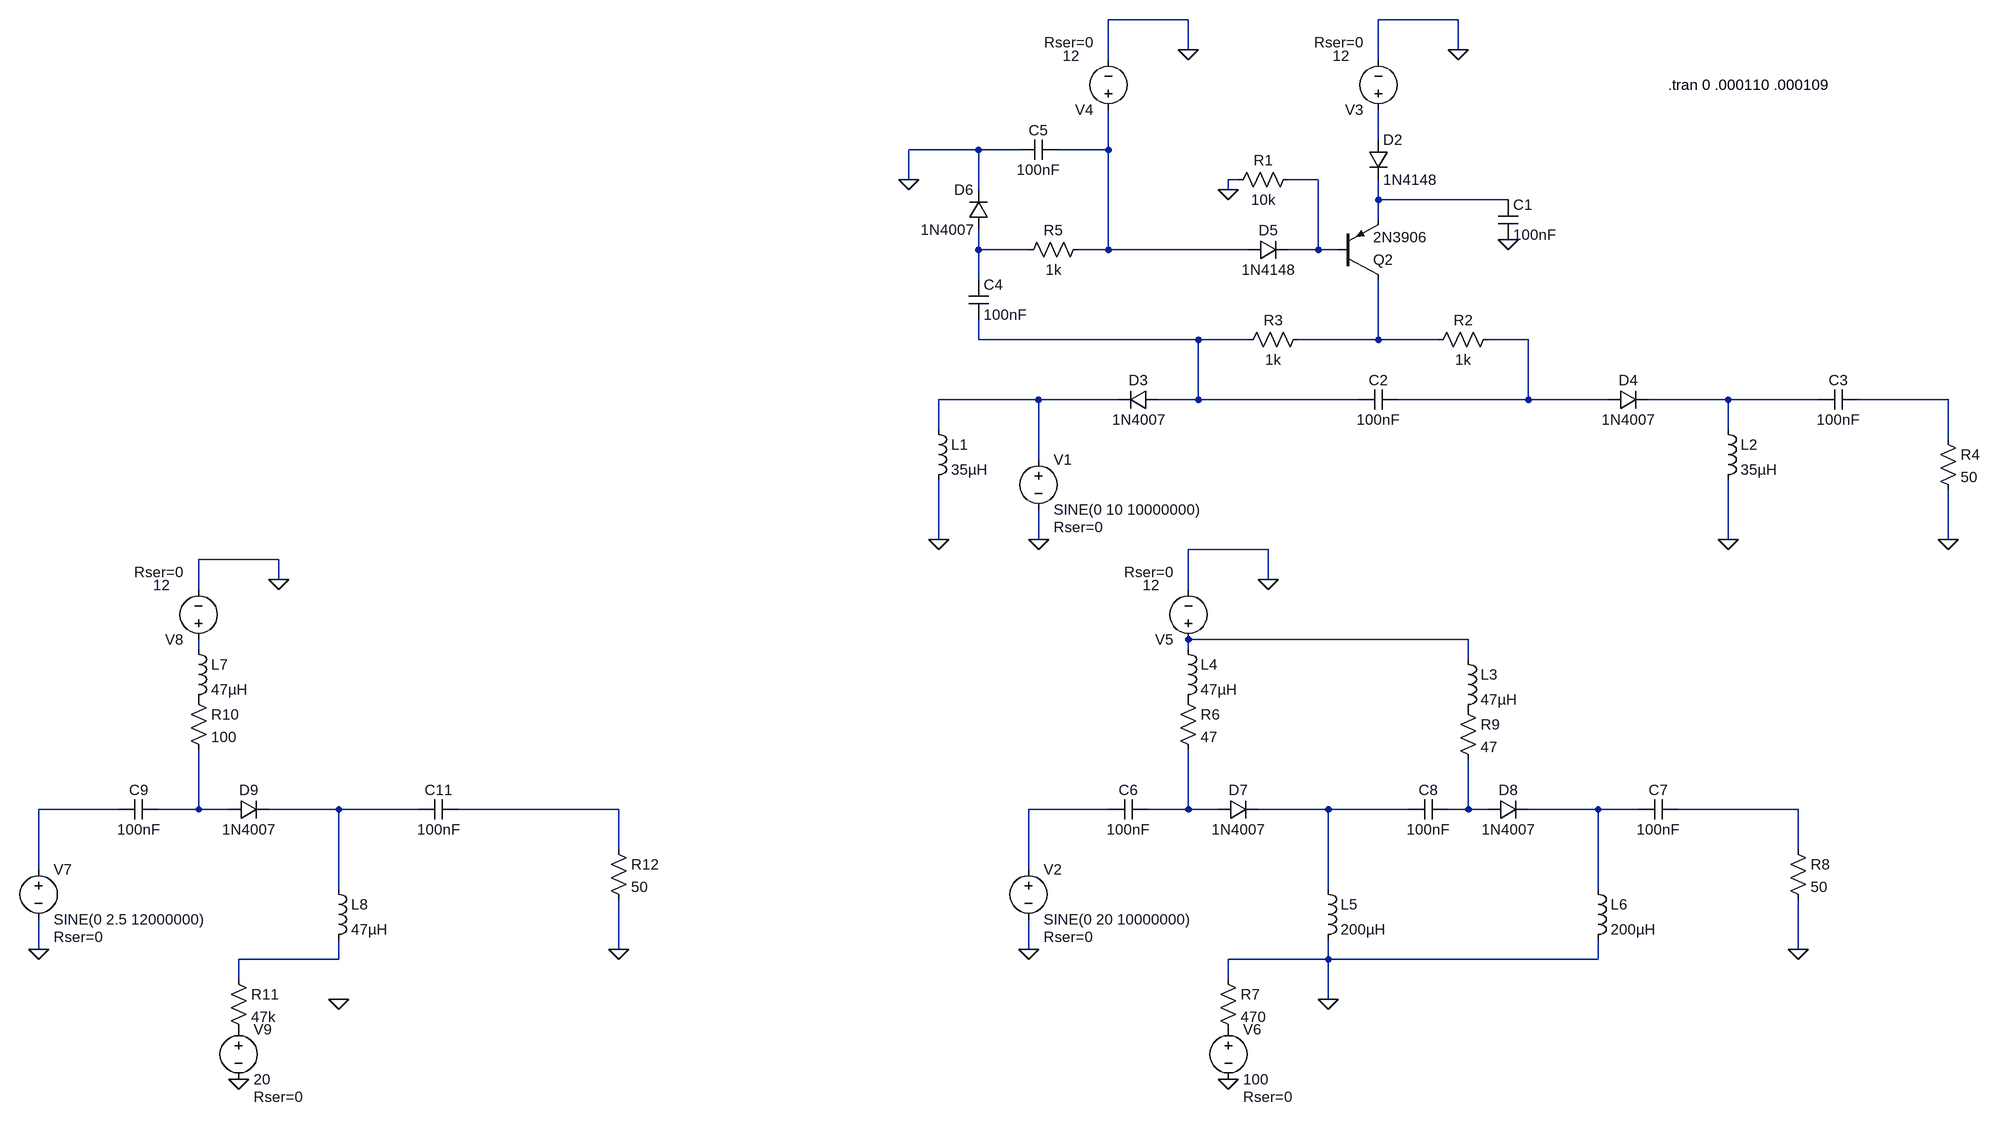
[diagram p0: schematic Pin Diodes.asc]
Pin Diodes.asc, the LTspice schematic file:
Version 4
SHEET 1 1732 1196
WIRE 192 -544 64 -544
WIRE 624 -544 496 -544
WIRE 192 -496 192 -544
WIRE 624 -496 624 -544
WIRE 64 -480 64 -544
WIRE 496 -480 496 -544
WIRE 496 -352 496 -400
WIRE -144 -336 -256 -336
WIRE -80 -336 -144 -336
WIRE 64 -336 64 -400
WIRE 64 -336 -16 -336
WIRE -256 -288 -256 -336
WIRE 272 -288 256 -288
WIRE 400 -288 352 -288
WIRE -144 -272 -144 -336
WIRE 256 -272 256 -288
WIRE 496 -256 496 -288
WIRE 704 -256 496 -256
WIRE 496 -224 496 -256
WIRE -144 -176 -144 -208
WIRE -64 -176 -144 -176
WIRE 64 -176 64 -336
WIRE 64 -176 16 -176
WIRE 288 -176 64 -176
WIRE 400 -176 400 -288
WIRE 400 -176 352 -176
WIRE 432 -176 400 -176
WIRE -144 -128 -144 -176
WIRE -144 -32 -144 -64
WIRE 208 -32 -144 -32
WIRE 288 -32 208 -32
WIRE 496 -32 496 -128
WIRE 496 -32 368 -32
WIRE 592 -32 496 -32
WIRE 736 -32 672 -32
WIRE -48 64 -208 64
WIRE 80 64 -48 64
WIRE 208 64 208 -32
WIRE 208 64 144 64
WIRE 464 64 208 64
WIRE 736 64 736 -32
WIRE 736 64 528 64
WIRE 864 64 736 64
WIRE 1056 64 928 64
WIRE 1200 64 1056 64
WIRE 1408 64 1264 64
WIRE -208 112 -208 64
WIRE 1056 112 1056 64
WIRE 1408 128 1408 64
WIRE -48 160 -48 64
WIRE -208 288 -208 192
WIRE -48 288 -48 240
WIRE 1056 288 1056 192
WIRE 1408 288 1408 208
WIRE 320 304 192 304
WIRE -1264 320 -1392 320
WIRE -1264 352 -1264 320
WIRE 320 352 320 304
WIRE -1392 368 -1392 320
WIRE 192 368 192 304
WIRE 640 448 192 448
WIRE -1392 464 -1392 448
WIRE 192 464 192 448
WIRE 640 480 640 448
WIRE -1520 720 -1648 720
WIRE -1392 720 -1392 624
WIRE -1392 720 -1456 720
WIRE -1344 720 -1392 720
WIRE -1168 720 -1280 720
WIRE -1040 720 -1168 720
WIRE -720 720 -976 720
WIRE 64 720 -64 720
WIRE 192 720 192 624
WIRE 192 720 128 720
WIRE 240 720 192 720
WIRE 416 720 304 720
WIRE 544 720 416 720
WIRE 640 720 640 640
WIRE 640 720 608 720
WIRE 672 720 640 720
WIRE 848 720 736 720
WIRE 912 720 848 720
WIRE 1168 720 976 720
WIRE -720 784 -720 720
WIRE 1168 784 1168 720
WIRE -1648 816 -1648 720
WIRE -64 816 -64 720
WIRE -1168 848 -1168 720
WIRE 416 848 416 720
WIRE 848 848 848 720
WIRE -1648 944 -1648 896
WIRE -720 944 -720 864
WIRE -64 944 -64 896
WIRE 1168 944 1168 864
WIRE -1168 960 -1168 928
WIRE -1168 960 -1328 960
WIRE 416 960 416 928
WIRE 416 960 256 960
WIRE 848 960 848 928
WIRE 848 960 416 960
WIRE -1328 992 -1328 960
WIRE 256 992 256 960
WIRE 416 1024 416 960
FLAG -48 288 0
FLAG 624 -496 0
FLAG 192 -496 0
FLAG 704 -192 0
FLAG 256 -272 0
FLAG -208 288 0
FLAG 1056 288 0
FLAG 1408 288 0
FLAG -256 -288 0
FLAG -64 944 0
FLAG 320 352 0
FLAG 1168 944 0
FLAG 256 1152 0
FLAG 416 1024 0
FLAG -1648 944 0
FLAG -1264 352 0
FLAG -720 944 0
FLAG -1328 1152 0
FLAG -1168 1024 0
SYMBOL voltage -48 144 R0
WINDOW 123 0 0 Left 0
WINDOW 39 24 124 Left 2
SYMATTR SpiceLine Rser=0
SYMATTR InstName V1
SYMATTR Value SINE(0 10 10000000)
SYMBOL voltage 496 -384 R180
WINDOW 123 0 0 Left 0
WINDOW 39 24 124 Left 2
WINDOW 3 46 103 Left 2
SYMATTR SpiceLine Rser=0
SYMATTR Value 12
SYMATTR InstName V3
SYMBOL voltage 64 -384 R180
WINDOW 123 0 0 Left 0
WINDOW 39 24 124 Left 2
WINDOW 3 46 103 Left 2
SYMATTR SpiceLine Rser=0
SYMATTR Value 12
SYMATTR InstName V4
SYMBOL pnp 432 -128 M180
SYMATTR InstName Q2
SYMATTR Value 2N3906
SYMBOL diode 480 -352 R0
SYMATTR InstName D2
SYMATTR Value 1N4148
SYMBOL res 368 -304 R90
WINDOW 0 0 56 VBottom 2
WINDOW 3 32 56 VTop 2
SYMATTR InstName R1
SYMATTR Value 10k
SYMBOL res 688 -48 R90
WINDOW 0 0 56 VBottom 2
WINDOW 3 32 56 VTop 2
SYMATTR InstName R2
SYMATTR Value 1k
SYMBOL res 384 -48 R90
WINDOW 0 0 56 VBottom 2
WINDOW 3 32 56 VTop 2
SYMATTR InstName R3
SYMATTR Value 1k
SYMBOL cap 688 -256 R0
SYMATTR InstName C1
SYMATTR Value 100nF
SYMBOL cap 528 48 R90
WINDOW 0 0 32 VBottom 2
WINDOW 3 32 32 VTop 2
SYMATTR InstName C2
SYMATTR Value 100nF
SYMBOL diode 144 48 R90
WINDOW 0 0 32 VBottom 2
WINDOW 3 32 32 VTop 2
SYMATTR InstName D3
SYMATTR Value 1N4007
SYMBOL ind -224 96 R0
SYMATTR InstName L1
SYMATTR Value 35µH
SYMBOL diode 864 80 R270
WINDOW 0 32 32 VTop 2
WINDOW 3 0 32 VBottom 2
SYMATTR InstName D4
SYMATTR Value 1N4007
SYMBOL ind 1040 96 R0
SYMATTR InstName L2
SYMATTR Value 35µH
SYMBOL cap 1264 48 R90
WINDOW 0 0 32 VBottom 2
WINDOW 3 32 32 VTop 2
SYMATTR InstName C3
SYMATTR Value 100nF
SYMBOL res 1392 112 R0
SYMATTR InstName R4
SYMATTR Value 50
SYMBOL diode 288 -160 R270
WINDOW 0 32 32 VTop 2
WINDOW 3 0 32 VBottom 2
SYMATTR InstName D5
SYMATTR Value 1N4148
SYMBOL res 32 -192 R90
WINDOW 0 0 56 VBottom 2
WINDOW 3 32 56 VTop 2
SYMATTR InstName R5
SYMATTR Value 1k
SYMBOL diode -128 -208 R180
WINDOW 0 24 64 Left 2
WINDOW 3 24 0 Left 2
SYMATTR InstName D6
SYMATTR Value 1N4007
SYMBOL cap -160 -128 R0
SYMATTR InstName C4
SYMATTR Value 100nF
SYMBOL cap -16 -352 R90
WINDOW 0 0 32 VBottom 2
WINDOW 3 32 32 VTop 2
SYMATTR InstName C5
SYMATTR Value 100nF
SYMBOL voltage -64 800 R0
WINDOW 123 0 0 Left 0
WINDOW 39 24 124 Left 2
SYMATTR SpiceLine Rser=0
SYMATTR InstName V2
SYMATTR Value SINE(0 20 10000000)
SYMBOL diode 240 736 R270
WINDOW 0 32 32 VTop 2
WINDOW 3 0 32 VBottom 2
SYMATTR InstName D7
SYMATTR Value 1N4007
SYMBOL voltage 192 464 R180
WINDOW 123 0 0 Left 0
WINDOW 39 24 124 Left 2
WINDOW 3 46 103 Left 2
SYMATTR SpiceLine Rser=0
SYMATTR Value 12
SYMATTR InstName V5
SYMBOL ind 176 448 R0
SYMATTR InstName L4
SYMATTR Value 47µH
SYMBOL res 176 528 R0
SYMATTR InstName R6
SYMATTR Value 47
SYMBOL cap 128 704 R90
WINDOW 0 0 32 VBottom 2
WINDOW 3 32 32 VTop 2
SYMATTR InstName C6
SYMATTR Value 100nF
SYMBOL res 240 976 R0
SYMATTR InstName R7
SYMATTR Value 470
SYMBOL ind 400 832 R0
SYMATTR InstName L5
SYMATTR Value 200µH
SYMBOL cap 976 704 R90
WINDOW 0 0 32 VBottom 2
WINDOW 3 32 32 VTop 2
SYMATTR InstName C7
SYMATTR Value 100nF
SYMBOL res 1152 768 R0
SYMATTR InstName R8
SYMATTR Value 50
SYMBOL voltage 256 1056 R0
WINDOW 123 0 0 Left 0
WINDOW 39 24 124 Left 2
SYMATTR SpiceLine Rser=0
SYMATTR InstName V6
SYMATTR Value 100
SYMBOL diode 672 736 R270
WINDOW 0 32 32 VTop 2
WINDOW 3 0 32 VBottom 2
SYMATTR InstName D8
SYMATTR Value 1N4007
SYMBOL cap 608 704 R90
WINDOW 0 0 32 VBottom 2
WINDOW 3 32 32 VTop 2
SYMATTR InstName C8
SYMATTR Value 100nF
SYMBOL ind 624 464 R0
SYMATTR InstName L3
SYMATTR Value 47µH
SYMBOL res 624 544 R0
SYMATTR InstName R9
SYMATTR Value 47
SYMBOL ind 832 832 R0
SYMATTR InstName L6
SYMATTR Value 200µH
SYMBOL voltage -1648 800 R0
WINDOW 123 0 0 Left 0
WINDOW 39 24 124 Left 2
SYMATTR SpiceLine Rser=0
SYMATTR InstName V7
SYMATTR Value SINE(0 2.5 12000000)
SYMBOL diode -1344 736 R270
WINDOW 0 32 32 VTop 2
WINDOW 3 0 32 VBottom 2
SYMATTR InstName D9
SYMATTR Value 1N4007
SYMBOL voltage -1392 464 R180
WINDOW 123 0 0 Left 0
WINDOW 39 24 124 Left 2
WINDOW 3 46 103 Left 2
SYMATTR SpiceLine Rser=0
SYMATTR Value 12
SYMATTR InstName V8
SYMBOL ind -1408 448 R0
SYMATTR InstName L7
SYMATTR Value 47µH
SYMBOL res -1408 528 R0
SYMATTR InstName R10
SYMATTR Value 100
SYMBOL cap -1456 704 R90
WINDOW 0 0 32 VBottom 2
WINDOW 3 32 32 VTop 2
SYMATTR InstName C9
SYMATTR Value 100nF
SYMBOL res -1344 976 R0
SYMATTR InstName R11
SYMATTR Value 47k
SYMBOL ind -1184 832 R0
SYMATTR InstName L8
SYMATTR Value 47µH
SYMBOL res -736 768 R0
SYMATTR InstName R12
SYMATTR Value 50
SYMBOL voltage -1328 1056 R0
WINDOW 123 0 0 Left 0
WINDOW 39 24 124 Left 2
SYMATTR SpiceLine Rser=0
SYMATTR InstName V9
SYMATTR Value 20
SYMBOL cap -976 704 R90
WINDOW 0 0 32 VBottom 2
WINDOW 3 32 32 VTop 2
SYMATTR InstName C11
SYMATTR Value 100nF
TEXT 960 -440 Left 2 !.tran 0 .000110 .000109

The netlist it stands for:
* Pin Diodes.asc
V1 N009 0 SINE(0 10 10000000) Rser=0
V3 N001 0 12 Rser=0
V4 N002 0 12 Rser=0
Q2 N007 N003 N004 0 2N3906
D2 N001 N004 1N4148
R1 N003 0 10k
R2 N008 N007 1k
R3 N007 N006 1k
C1 N004 0 100nF
C2 N008 N006 100nF
D3 N006 N009 1N4007
L1 N009 0 35µH
D4 N008 N010 1N4007
L2 N010 0 35µH
C3 N011 N010 100nF
R4 N011 0 50
D5 N002 N003 1N4148
R5 N002 N005 1k
D6 N005 0 1N4007
C4 N005 N006 100nF
C5 N002 0 100nF
V2 N018 0 SINE(0 20 10000000) Rser=0
D7 N019 N020 1N4007
V5 N012 0 12 Rser=0
L4 N012 P001 47µH
R6 P001 N019 47
C6 N019 N018 100nF
R7 0 P002 470
L5 N020 0 200µH
C7 N023 N022 100nF
R8 N023 0 50
V6 P002 0 100 Rser=0
D8 N021 N022 1N4007
C8 N021 N020 100nF
L3 N012 P003 47µH
R9 P003 N021 47
L6 N022 0 200µH
V7 N014 0 SINE(0 2.5 12000000) Rser=0
D9 N015 N016 1N4007
V8 N013 0 12 Rser=0
L7 N013 P004 47µH
R10 P004 N015 100
C9 N015 N014 100nF
R11 N024 P005 47k
L8 N016 N024 47µH
R12 N017 0 50
V9 P005 0 20 Rser=0
C11 N017 N016 100nF
.model D D
.lib standard.dio
.model NPN NPN
.model PNP PNP
.lib standard.bjt
.tran 0 .000110 .000109
.backanno
.end